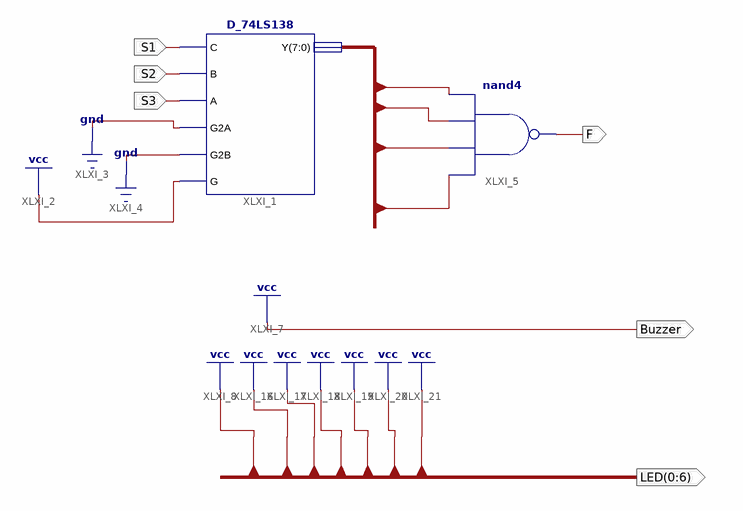
[diagram p0: schematic sheet 1]
// Xilinx ISE schematic LampCtrl138.sch (kintex7) as structural Verilog: 2 symbols, 6 ports
module LampCtrl138 (
  input  S1,
  input  S2,
  input  S3,
  output F,
  output Buzzer,
  output [0:6] LED
);

  wire [7:0] Y;

  D_74LS138 XLXI_1 (.C(S1), .B(S2), .A(S3), .G2A(1'b0), .G2B(1'b0), .G(1'b1), .Y(Y));
  nand XLXI_5 (F, Y[7], Y[4], Y[2], Y[1]);

  assign Buzzer = 1'b1;
  assign LED = {7{1'b1}};
endmodule
